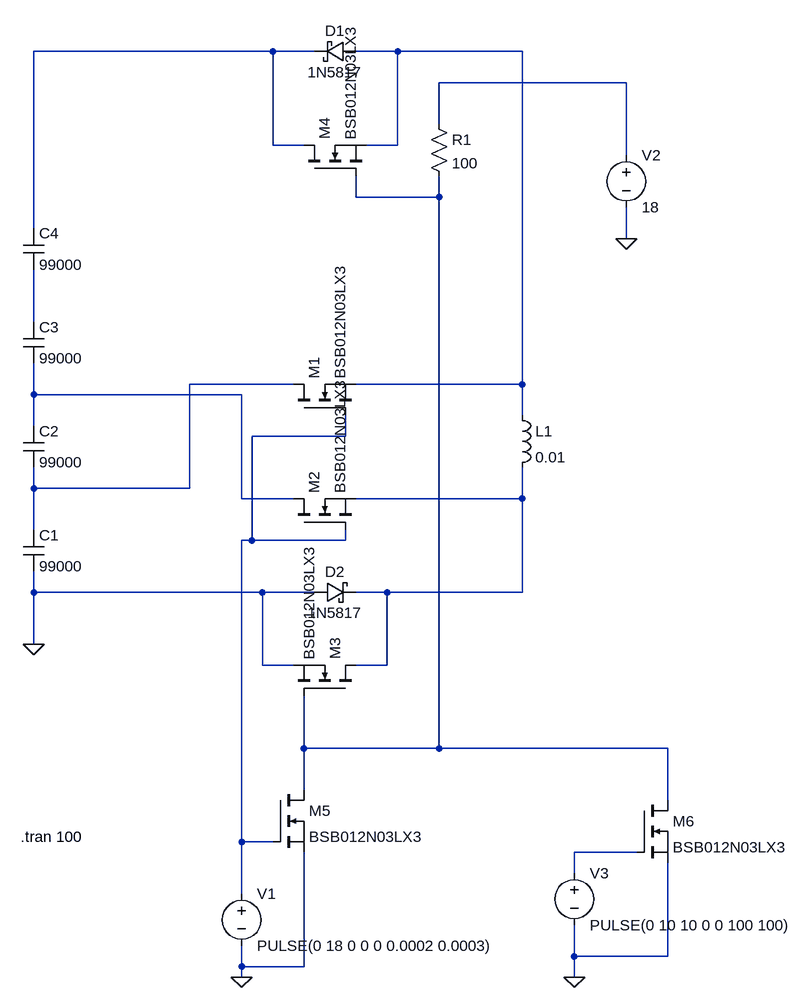
[diagram p0: schematic balance_inductance.asc]
balance_inductance.asc, the LTspice schematic file:
Version 4
SHEET 1 1244 852
WIRE 352 -592 -16 -592
WIRE 416 -592 352 -592
WIRE 544 -592 480 -592
WIRE 736 -592 544 -592
WIRE 896 -544 608 -544
WIRE 608 -480 608 -544
WIRE 352 -448 352 -592
WIRE 400 -448 352 -448
WIRE 544 -448 544 -592
WIRE 544 -448 496 -448
WIRE 896 -432 896 -544
WIRE 480 -368 480 -400
WIRE 608 -368 608 -400
WIRE 608 -368 480 -368
WIRE -16 -320 -16 -592
WIRE 896 -304 896 -352
WIRE -16 -176 -16 -256
WIRE 384 -80 224 -80
WIRE 736 -80 736 -592
WIRE 736 -80 480 -80
WIRE -16 -64 -16 -112
WIRE 304 -64 -16 -64
WIRE 736 -32 736 -80
WIRE -16 -16 -16 -64
WIRE 464 0 464 -32
WIRE 464 0 320 0
WIRE -16 80 -16 48
WIRE 224 80 224 -80
WIRE 224 80 -16 80
WIRE 304 96 304 -64
WIRE 384 96 304 96
WIRE 736 96 736 48
WIRE 736 96 480 96
WIRE -16 144 -16 80
WIRE 320 160 320 0
WIRE 320 160 304 160
WIRE 464 160 464 144
WIRE 464 160 320 160
WIRE -16 240 -16 208
WIRE 336 240 -16 240
WIRE 416 240 336 240
WIRE 528 240 480 240
WIRE 736 240 736 96
WIRE 736 240 528 240
WIRE -16 320 -16 240
WIRE 336 352 336 240
WIRE 384 352 336 352
WIRE 528 352 528 240
WIRE 528 352 480 352
WIRE 400 480 400 400
WIRE 608 480 608 -368
WIRE 608 480 400 480
WIRE 960 480 608 480
WIRE 400 544 400 480
WIRE 960 560 960 480
WIRE 304 624 304 160
WIRE 352 624 304 624
WIRE 912 640 816 640
WIRE 816 672 816 640
WIRE 304 704 304 624
WIRE 816 800 816 752
WIRE 960 800 960 656
WIRE 960 800 816 800
WIRE 304 816 304 784
WIRE 400 816 400 640
WIRE 400 816 304 816
WIRE 304 832 304 816
WIRE 816 832 816 800
FLAG -16 320 0
FLAG 304 832 0
FLAG 896 -304 0
FLAG 816 832 0
SYMBOL cap -32 144 R0
SYMATTR InstName C1
SYMATTR Value 99000
SYMATTR SpiceLine Rser=0.2,IC=3.2
SYMBOL cap -32 -16 R0
SYMATTR InstName C2
SYMATTR Value 99000
SYMATTR SpiceLine Rser=0.2,IC=3.3
SYMBOL cap -32 -176 R0
SYMATTR InstName C3
SYMATTR Value 99000
SYMATTR SpiceLine Rser=0.2,IC=3.2
SYMBOL cap -32 -320 R0
SYMATTR InstName C4
SYMATTR Value 99000
SYMATTR SpiceLine Rser=0.2,IC=3.2
SYMBOL ind 720 -48 R0
SYMATTR InstName L1
SYMATTR Value 0.01
SYMATTR SpiceLine Ipk=0.11 Rser=39
SYMBOL nmos 384 -32 R270
SYMATTR InstName M1
SYMATTR Value BSB012N03LX3
SYMBOL nmos 384 144 R270
SYMATTR InstName M2
SYMATTR Value BSB012N03LX3
SYMBOL schottky 480 -608 R90
WINDOW 0 0 32 VBottom 2
WINDOW 3 32 32 VTop 2
SYMATTR InstName D1
SYMATTR Value 1N5817
SYMATTR Description Diode
SYMATTR Type diode
SYMBOL schottky 416 256 R270
WINDOW 0 32 32 VTop 2
WINDOW 3 0 32 VBottom 2
SYMATTR InstName D2
SYMATTR Value 1N5817
SYMATTR Description Diode
SYMATTR Type diode
SYMBOL voltage 304 688 R0
WINDOW 123 0 0 Left 0
WINDOW 39 0 0 Left 0
SYMATTR InstName V1
SYMATTR Value PULSE(0 18 0 0 0 0.0002 0.0003)
SYMBOL nmos 480 400 M270
SYMATTR InstName M3
SYMATTR Value BSB012N03LX3
SYMBOL nmos 400 -400 R270
SYMATTR InstName M4
SYMATTR Value BSB012N03LX3
SYMBOL nmos 352 544 R0
SYMATTR InstName M5
SYMATTR Value BSB012N03LX3
SYMBOL res 592 -496 R0
SYMATTR InstName R1
SYMATTR Value 100
SYMBOL voltage 896 -448 R0
WINDOW 123 0 0 Left 0
WINDOW 39 0 0 Left 0
SYMATTR InstName V2
SYMATTR Value 18
SYMBOL nmos 912 560 R0
SYMATTR InstName M6
SYMATTR Value BSB012N03LX3
SYMBOL voltage 816 656 R0
WINDOW 123 0 0 Left 0
WINDOW 39 0 0 Left 0
SYMATTR InstName V3
SYMATTR Value PULSE(0 10 10 0 0 100 100)
TEXT -36 616 Left 2 !.tran 100

The netlist it stands for:
* balance_inductance.asc
C1 N006 0 99000 Rser=0.2,IC=3.2
C2 N007 N006 99000 Rser=0.2,IC=3.3
C3 N005 N007 99000 Rser=0.2,IC=3.2
C4 N001 N005 99000 Rser=0.2,IC=3.2
L1 N002 N009 0.01 Ipk=0.11 Rser=39
M1 N006 N008 N002 N002 BSB012N03LX3
M2 N007 N008 N009 N009 BSB012N03LX3
D1 N002 N001 1N5817
D2 0 N009 1N5817
V1 N008 0 PULSE(0 18 0 0 0 0.0002 0.0003)
M3 N009 N004 0 0 BSB012N03LX3
M4 N001 N004 N002 N002 BSB012N03LX3
M5 N004 N008 0 0 BSB012N03LX3
R1 N003 N004 100
V2 N003 0 18
M6 N004 N010 0 0 BSB012N03LX3
V3 N010 0 PULSE(0 10 10 0 0 100 100)
.model D D
.lib standard.dio
.model NMOS NMOS
.model PMOS PMOS
.lib standard.mos
.tran 100
.backanno
.end